# Altium schematic sheet AL1000.SchDoc
size A4; PageSetup: Record=PageOptions|CenterHorizontal=True|CenterVertical=True|PrintScale=1.00|XCorrection=1.00|YCorrection=1.00|PrintKind=1|BorderSize=5000000|LeftOffset=0|BottomOffset=0|Orientation=2|PaperLength=1000|PaperWidth=1000|Scale=100|PaperSource=7|PrintQuality=-3|MediaType=1|DitherType=10|PrintScaleMode=1|PaperKind=A1(594x841mm)|PaperIndex=135
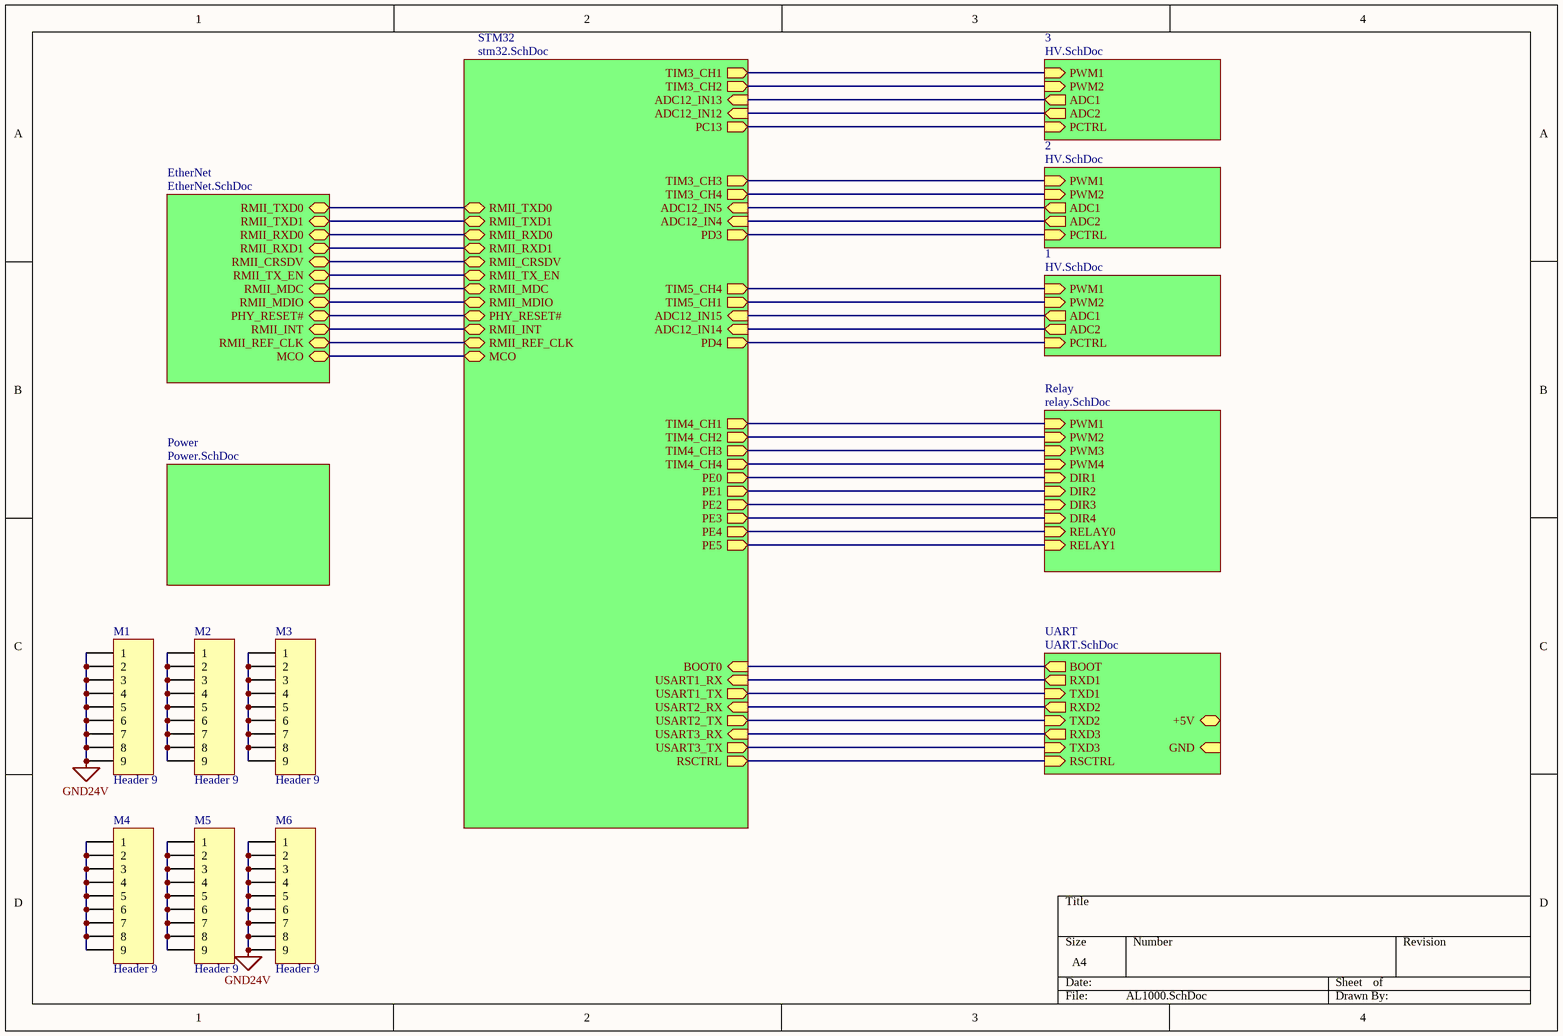
[diagram p0: AL1000.SchDoc]

## Parts
M1  Header 9  [LK]
M2  Header 9  [LK]
M3  Header 9  [LK]
M4  Header 9  [LK]
M5  Header 9  [LK]
M6  Header 9  [LK]

## Sub-sheets
1 = HV.SchDoc: ADC1 (out), ADC2 (out), PWM1 (in), PWM2 (in), PCTRL (in)
2 = HV.SchDoc: ADC1 (out), ADC2 (out), PWM1 (in), PWM2 (in), PCTRL (in)
3 = HV.SchDoc: ADC1 (out), ADC2 (out), PWM1 (in), PWM2 (in), PCTRL (in)
EtherNet = EtherNet.SchDoc: RMII_TXD0, RMII_TXD1, RMII_RXD0, RMII_RXD1, RMII_CRSDV, RMII_TX_EN, RMII_MDC, RMII_MDIO, PHY_RESET#, RMII_INT, RMII_REF_CLK, MCO
Power = Power.SchDoc: no entries
Relay = relay.SchDoc: DIR2 (in), DIR1 (in), PWM1 (in), PWM2 (in), PWM3 (in), PWM4 (in), DIR3 (in), DIR4 (in), RELAY0 (in), RELAY1 (in)
STM32 = stm32.SchDoc: TIM3_CH1 (out), TIM3_CH2 (out), TIM3_CH3 (out), TIM3_CH4 (out), ADC12_IN12 (in), ADC12_IN13 (in), ADC12_IN14 (in), ADC12_IN15 (in), PD3 (out), PD4 (out), RMII_TXD0, RMII_TXD1, RMII_RXD0, RMII_RXD1, RMII_CRSDV, RMII_TX_EN, RMII_MDC, RMII_MDIO, PHY_RESET#, RMII_INT, RMII_REF_CLK, MCO, USART1_TX (out), USART1_RX (in), USART2_TX (out), USART3_TX (out), USART2_RX (in), USART3_RX (in), RSCTRL (out), BOOT0 (in), TIM4_CH1 (out), TIM4_CH2 (out), TIM4_CH3 (out), TIM4_CH4 (out), PE0 (out), PE1 (out), PE2 (out), PE3 (out), TIM5_CH1 (out), TIM5_CH4 (out), ADC12_IN4 (in), ADC12_IN5 (in), PC13 (out), PE4 (out), PE5 (out)
UART = UART.SchDoc: BOOT (out), RXD1 (out), TXD1 (in), RXD2 (out), TXD2 (in), RXD3 (out), TXD3 (in), GND (in), +5V, RSCTRL (in)

## Nets
GND24V: M1.1 M1.2 M1.3 M1.4 M1.5 M1.6 M1.7 M1.8 M1.9 M6.1 M6.2 M6.3 M6.4 M6.5 M6.6 M6.7 M6.8 M6.9
NetM2_1: M2.1 M2.2 M2.3 M2.4 M2.5 M2.6 M2.7 M2.8 M2.9
NetM3_1: M3.1 M3.2 M3.3 M3.4 M3.5 M3.6 M3.7 M3.8 M3.9
NetM4_1: M4.1 M4.2 M4.3 M4.4 M4.5 M4.6 M4.7 M4.8 M4.9
NetM5_1: M5.1 M5.2 M5.3 M5.4 M5.5 M5.6 M5.7 M5.8 M5.9
(unnamed): sheet STM32/TIM3_CH1, sheet 3/PWM1
(unnamed): sheet STM32/TIM3_CH2, sheet 3/PWM2
(unnamed): sheet STM32/TIM3_CH3, sheet 2/PWM1
(unnamed): sheet STM32/TIM3_CH4, sheet 2/PWM2
(unnamed): sheet STM32/ADC12_IN12, sheet 3/ADC2
(unnamed): sheet STM32/ADC12_IN13, sheet 3/ADC1
(unnamed): sheet STM32/ADC12_IN14, sheet 1/ADC2
(unnamed): sheet STM32/ADC12_IN15, sheet 1/ADC1
(unnamed): sheet STM32/PD3, sheet 2/PCTRL
(unnamed): sheet STM32/PD4, sheet 1/PCTRL
(unnamed): sheet STM32/RMII_TXD0, sheet EtherNet/RMII_TXD0
(unnamed): sheet STM32/RMII_TXD1, sheet EtherNet/RMII_TXD1
(unnamed): sheet STM32/RMII_RXD0, sheet EtherNet/RMII_RXD0
(unnamed): sheet STM32/RMII_RXD1, sheet EtherNet/RMII_RXD1
(unnamed): sheet STM32/RMII_CRSDV, sheet EtherNet/RMII_CRSDV
(unnamed): sheet STM32/RMII_TX_EN, sheet EtherNet/RMII_TX_EN
(unnamed): sheet STM32/RMII_MDC, sheet EtherNet/RMII_MDC
(unnamed): sheet STM32/RMII_MDIO, sheet EtherNet/RMII_MDIO
(unnamed): sheet STM32/PHY_RESET#, sheet EtherNet/PHY_RESET#
(unnamed): sheet STM32/RMII_INT, sheet EtherNet/RMII_INT
(unnamed): sheet STM32/RMII_REF_CLK, sheet EtherNet/RMII_REF_CLK
(unnamed): sheet STM32/MCO, sheet EtherNet/MCO
(unnamed): sheet STM32/USART1_TX, sheet UART/TXD1
(unnamed): sheet STM32/USART1_RX, sheet UART/RXD1
(unnamed): sheet STM32/USART2_TX, sheet UART/TXD2
(unnamed): sheet STM32/USART3_TX, sheet UART/TXD3
(unnamed): sheet STM32/USART2_RX, sheet UART/RXD2
(unnamed): sheet STM32/USART3_RX, sheet UART/RXD3
(unnamed): sheet STM32/RSCTRL, sheet UART/RSCTRL
(unnamed): sheet STM32/BOOT0, sheet UART/BOOT
(unnamed): sheet STM32/TIM4_CH1, sheet Relay/PWM1
(unnamed): sheet STM32/TIM4_CH2, sheet Relay/PWM2
(unnamed): sheet STM32/TIM4_CH3, sheet Relay/PWM3
(unnamed): sheet STM32/TIM4_CH4, sheet Relay/PWM4
(unnamed): sheet STM32/PE0, sheet Relay/DIR1
(unnamed): sheet STM32/PE1, sheet Relay/DIR2
(unnamed): sheet STM32/PE2, sheet Relay/DIR3
(unnamed): sheet STM32/PE3, sheet Relay/DIR4
(unnamed): sheet STM32/TIM5_CH1, sheet 1/PWM2
(unnamed): sheet STM32/TIM5_CH4, sheet 1/PWM1
(unnamed): sheet STM32/ADC12_IN4, sheet 2/ADC2
(unnamed): sheet STM32/ADC12_IN5, sheet 2/ADC1
(unnamed): sheet STM32/PC13, sheet 3/PCTRL
(unnamed): sheet STM32/PE4, sheet Relay/RELAY0
(unnamed): sheet STM32/PE5, sheet Relay/RELAY1

## Library data of the parts
M1-M6 = Header 9: Header, 9-Pin; LatestRevisionDate: 17-Jul-2002; LatestRevisionNote: Re-released for DXP Platform.; Publisher: Altium Limited